# EAGLE design PCB_taller (EAGLE 9.7.0)
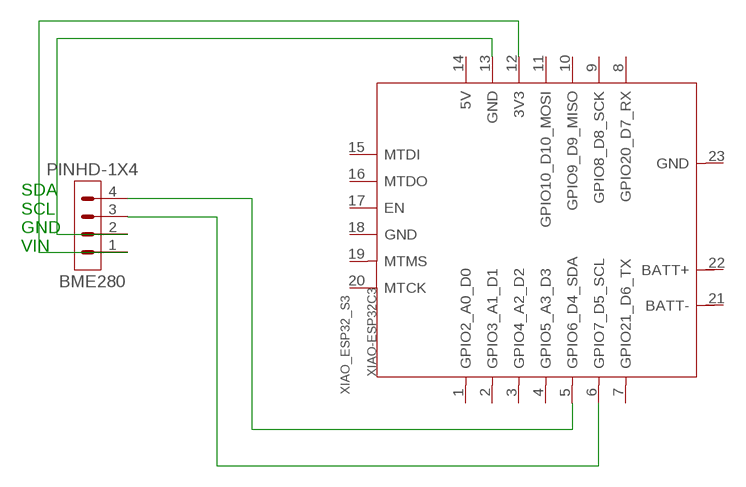
[diagram p0: schematic, sheet 1]

## Parts
BME280  PINHD-1X4  [1X04]
XIAO_ESP32_S3  XIAO-ESP32C3  [XIAO-ESP32C3-MODULE14P-2.54-21X17.8MM]

## Nets
N$1: BME280.4 XIAO_ESP32_S3.5(GPIO6_D4_SDA)
N$2: BME280.3 XIAO_ESP32_S3.6(GPIO7_D5_SCL)
N$3: BME280.2 XIAO_ESP32_S3.13(GND)
N$4: BME280.1 XIAO_ESP32_S3.12(3V3)
Unconnected: XIAO_ESP32_S3.1(GPIO2_A0_D0) XIAO_ESP32_S3.2(GPIO3_A1_D1) XIAO_ESP32_S3.3(GPIO4_A2_D2) XIAO_ESP32_S3.4(GPIO5_A3_D3) XIAO_ESP32_S3.7(GPIO21_D6_TX) XIAO_ESP32_S3.8(GPIO20_D7_RX) XIAO_ESP32_S3.9(GPIO8_D8_SCK) XIAO_ESP32_S3.10(GPIO9_D9_MISO) XIAO_ESP32_S3.11(GPIO10_D10_MOSI) XIAO_ESP32_S3.14(5V) XIAO_ESP32_S3.15(MTDI) XIAO_ESP32_S3.16(MTDO) XIAO_ESP32_S3.17(EN) XIAO_ESP32_S3.18(GND) XIAO_ESP32_S3.19(MTMS) XIAO_ESP32_S3.20(MTCK) XIAO_ESP32_S3.21(BATT-) XIAO_ESP32_S3.22(BATT+) XIAO_ESP32_S3.23(GND)

## Notes on the sheet
- SDA
  SCL
  GND
  VIN

## Library data of the parts
BME280 = Connector:PINHD-1X4: Pin Header
XIAO_ESP32_S3 = Seeed Studio XIAO Series:XIAO-ESP32C3: Seeed Studio XIAO ESP32C3 - Espressif ESP32-C3 WiFi BLE Microcontroller - 32-bit 160MHz RISC-V processor Seeed SKU: 113991054 Seeed Studio XIAO ESP32C3 featuring ESP32C3 carries a complete Wi-Fi system along with Bluetooth Low Energy function. With its exquisite design, WiFi+BT ability, it's perfect for various IoT controlling scenarios and complex carriable applications. Buy now <https://www.seeedstudio.com/Seeed-XIAO-ESP32C3-p-5431.html> Wiki <https://wiki.seeedstudio.com/XIAO_ESP32C3_Getting_Started/>

## Board
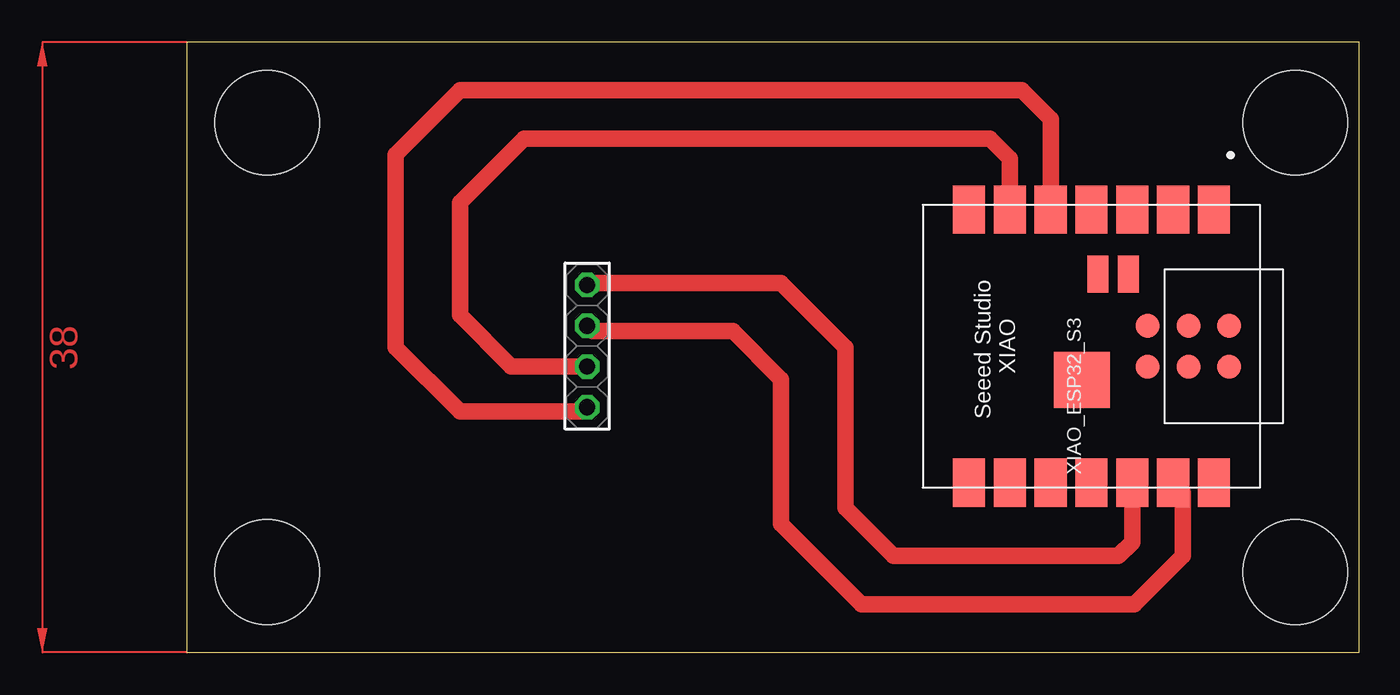
[diagram p1: board, top side]

Size 73 x 38 mm. Coordinates in mm from the lower left corner, seen from the top.
Outline: 0,0 73,0 73,38 0,38 0,0
Copper layers (1*16): Top / Bottom
Stack-up Default Layer Stack: Top SilkScreen Epoxy Ink / Top SolderMask SR:Green 0.0254mm Dk 4.3 / Top Surface Finish Lead-Free 0.02mm / Top CuFoil:007 0.035mm / Dielectric-1 User Defined 1.5mm / Bottom CuFoil:007 0.035mm / Bottom Surface Finish Lead-Free 0.02mm / Bottom SolderMask SR:Green 0.0254mm Dk 4.3 / Bottom SilkScreen Epoxy Ink
Design rules: minimum copper width 6mil, minimum drill size 0.35mm, copper clearance wire_polygon to wire_polygon 6mil, copper clearance wire_polygon to pad_smd 6mil, copper clearance wire_polygon to via 6mil, copper clearance pad_smd to pad_smd 6mil, copper clearance pad_smd to via 6mil, copper clearance via to via 6mil, copper clearance smd to pad (same net) 6mil, copper clearance smd to via (same net) 6mil, copper clearance smd to smd (same net) 6mil, dimension clearance 40mil, via restrict clearance 0mil, restrict clearance 0mil, drill distance 6mil, keepout clearance 0mil
Holes 6.5 mm at 69,5 5,5 5,33 69,33

### Footprints (pad centres in the part's own frame; a part is rotated, then mirrored left to right if it is on the bottom)
1X04 = drill 1.016 octagon: 1 -3.81,0; 2 -1.27,0; 3 1.27,0; 4 3.81,0
XIAO-ESP32C3-MODULE14P-2.54-21X17.8MM = smd 3 x 2: 1 -8.5,7.62; 2 -8.5,5.08; 3 -8.5,2.54; 4 -8.5,0; 5 -8.5,-2.54; 6 -8.5,-5.08; 7 -8.5,-7.62; 8 8.5,-7.62; 9 8.5,-5.08; 10 8.5,-2.54; 11 8.5,0; 12 8.5,2.54; 13 8.5,5.08; 14 8.5,7.62 | smd 1.5 x 1.5: 15 -1.27,8.58; 16 1.27,8.58; 17 -1.27,6.04; 18 1.27,6.04; 19 -1.27,3.5; 20 1.27,3.5 | smd 2.3 x 1.3: 21 -4.5,2.3; 22 -4.5,0.4 | smd 3.5 x 3.5: 23 2.1,-0.6

### Placement (x,y rotation side)
BME280  24.92,19.07 270 top
XIAO_ESP32_S3  56.32,19.07 270 top

### Tracks (layer width: path | path; a pad name or v marks a point on that pad's centre or on a via)
N$1
  Top 1.016: XIAO_ESP32_S3.5 53.78,33.22 52,35 17,35 13,31 13,19 17,15 24.66,15 BME280.4
N$2
  Top 1.016: XIAO_ESP32_S3.6 51.24,30.76 50,32 21,32 17,28 17,21 20.2,17.8 BME280.3
N$3
  Top 0.152: 61.71,10.26 61.49,10.48 XIAO_ESP32_S3.13
  Top 1.016: BME280.2 25.26,20 34,20 37,17 37,8 42,3 59,3 62,6 62,9.97 61.49,10.48
N$4
  Top 1.016: XIAO_ESP32_S3.12 58.86,6.86 58,6 44,6 41,9 41,19 37,23 25.04,23 BME280.1
(copper drawn outside any net)
  shapes: Top area x1